# EAGLE design perfboard-tvbgone (EAGLE 5.06)
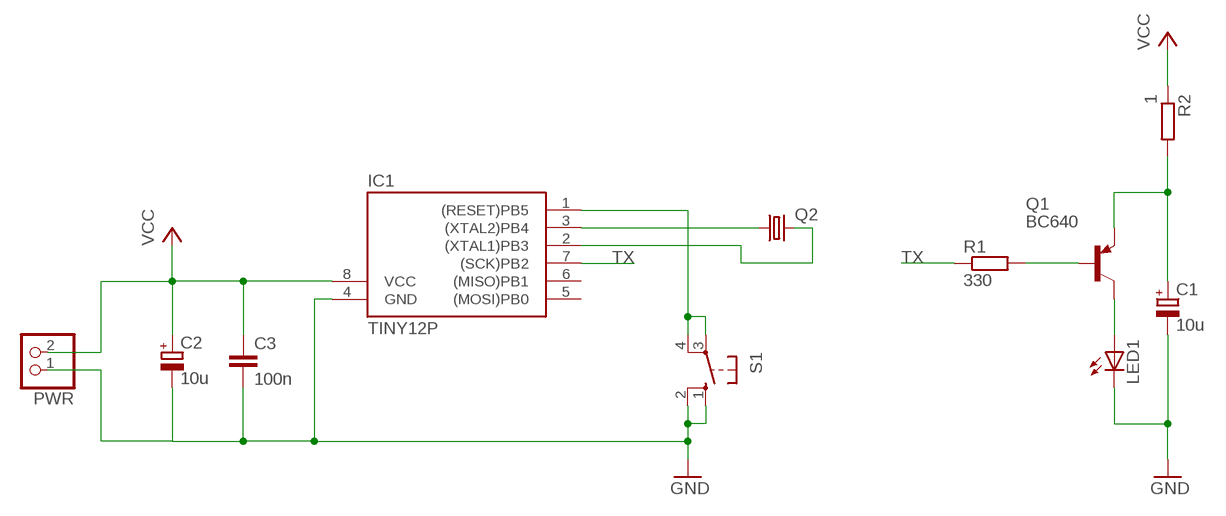
[diagram p0: schematic, sheet 1]

## Parts
C1  10u  CPOL-EUE2-4  [E2-4]
C2  10u  CPOL-EUE2-4  [E2-4]
C3  100n  C-EU050-025X075  [C050-025X075]
IC1  TINY12P  [DIL08]
LED1  LED5MM  [LED5MM]
PWR  PINHD-1X2  [1X02]
Q1  BC640  [TO92-BCE]
Q2  CRYSTALHC49S  [HC49/S]
R1  330  R-EU_0207/7  [0207/7]
R2  1  R-EU_0207/7  [0207/7]
S1  10-XX  [B3F-10XX]

## Nets
GND: C1.- C2.- C3.2 IC1.4(GND) LED1.K(C) PWR.1 S1.1(S) S1.2(S1)
N$7: Q1.B R1.2
N$8: LED1.A Q1.C
N$9: C1.+ Q1.E R2.2
N$10: IC1.3((XTAL2)PB4) Q2.1
N$11: IC1.2((XTAL1)PB3) Q2.2
N$12: IC1.1((RESET)PB5) S1.3(P) S1.4(P1)
TX: IC1.7((SCK)PB2) R1.1
VCC: C2.+ C3.1 IC1.8(VCC) PWR.2 R2.1
Unconnected: IC1.5((MOSI)PB0) IC1.6((MISO)PB1)

## Library data of the parts
C1 C2 = rcl:CPOL-EU: POLARIZED CAPACITOR, European symbol
C3 = rcl:C-EU: CAPACITOR, European symbol
IC1 = atmel:TINY12*: MICROCONTROLLER 1 Kbytes FLASH 64 bytes EEPROM
LED1 = led:LED: LED OSRAM: - CHIPLED LG R971, LG N971, LY N971, LG Q971, LY Q971, LO R971, LY R971 LH N974, LH R974 LS Q976, LO Q976, LY Q976 LO Q996 - Hyper CHIPLED LW Q18S LB Q993, LB Q99A, LB R99A - SideLED LS A670, LO A670, LY A670, LG A670, LP A670 LB A673, LV A673, LT A673, LW A673 LH A674 LY A675 LS A676, LA A676, LO A676, LY A676, LW A676 LS A679, LY A679, LG A679 - Hyper Micro SIDELED® LS Y876, LA Y876, LO Y876, LY Y876 LT Y87S - SmartLED LW L88C, LW L88S LB L89C, LB L89S, LG L890 LS L89K, LO L89K, LY L89K LS L896, LA L896, LO L896, LY L896 - TOPLED LS T670, LO T670, LY T670, LG T670, LP T670 LSG T670, LSP T670, LSY T670, LOP T670, LYG T670 LG T671, LOG T671, LSG T671 LB T673, LV T673, LT T673, LW T673 LH T674 LS T676, LA T676, LO T676, LY T676, LB T676, LH T676, LSB T676, LW T676 LB T67C, LV T67C, LT T67C, LS T67K, LO T67K, LY T67K, LW E67C LS E67B, LA E67B, LO E67B, LY E67B, LB E67C, LV E67C, LT E67C LW T67C LS T679, LY T679, LG T679 LS T770, LO T770, LY T770, LG T770, LP T770 LB T773, LV T773, LT T773, LW T773 LH T774 LS E675, LA E675, LY E675, LS T675 LS T776, LA T776, LO T776, LY T776, LB T776 LHGB T686 LT T68C, LB T68C - Hyper Mini TOPLED® LB M676 - Mini TOPLED Santana® LG M470 LS M47K, LO M47K, LY M47K Source: http://www.osram.convergy.de LUXEON: - LUMILED® LXK2-PW12-R00, LXK2-PW12-S00, LXK2-PW14-U00, LXK2-PW14-V00 LXK2-PM12-R00, LXK2-PM12-S00, LXK2-PM14-U00 LXK2-PE12-Q00, LXK2-PE12-R00, LXK2-PE12-S00, LXK2-PE14-T00, LXK2-PE14-U00 LXK2-PB12-K00, LXK2-PB12-L00, LXK2-PB12-M00, LXK2-PB14-N00, LXK2-PB14-P00, LXK2-PB14-Q00 LXK2-PR12-L00, LXK2-PR12-M00, LXK2-PR14-Q00, LXK2-PR14-R00 LXK2-PD12-Q00, LXK2-PD12-R00, LXK2-PD12-S00 LXK2-PH12-R00, LXK2-PH12-S00 LXK2-PL12-P00, LXK2-PL12-Q00, LXK2-PL12-R00 Source: www.luxeon.com KINGBRIGHT: KA-3528ASYC Source: www.kingbright.com
PWR = pinhead:PINHD-1X2: PIN HEADER
Q1 = transistor-pnp:BC640*: PNP Transistror
Q2 = crystal:CRYSTAL: CRYSTAL
R1 R2 = rcl:R-EU_: RESISTOR, European symbol
S1 = switch-omron:10-XX: OMRON SWITCH

## Board
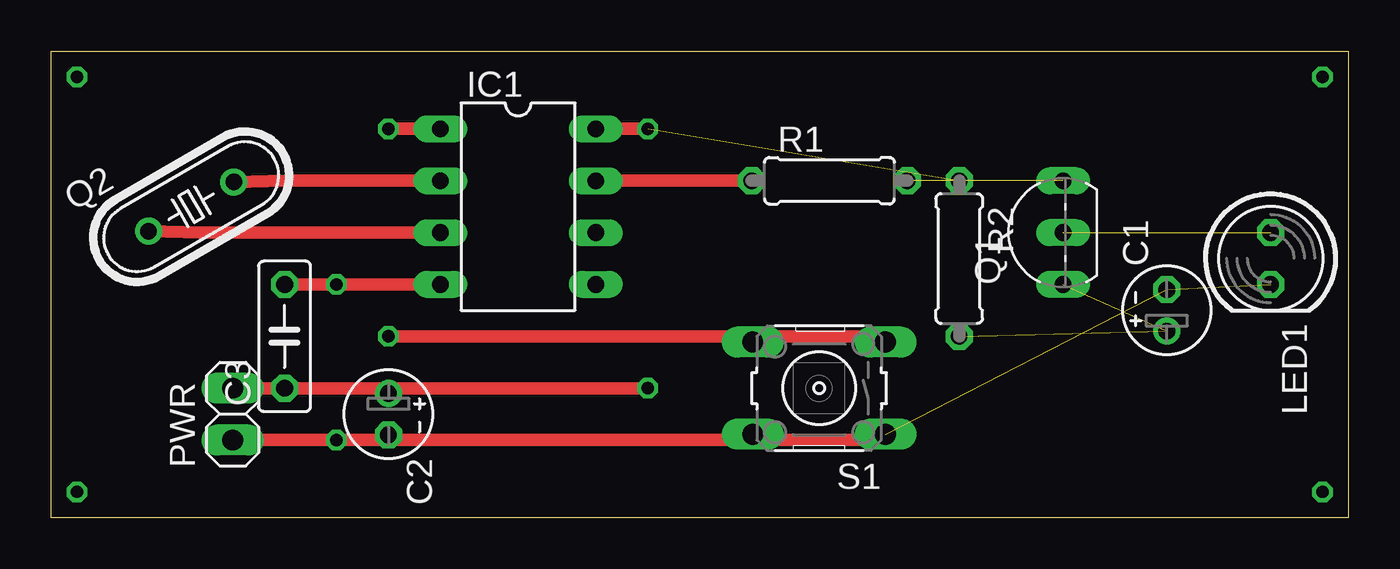
[diagram p1: board, top side]
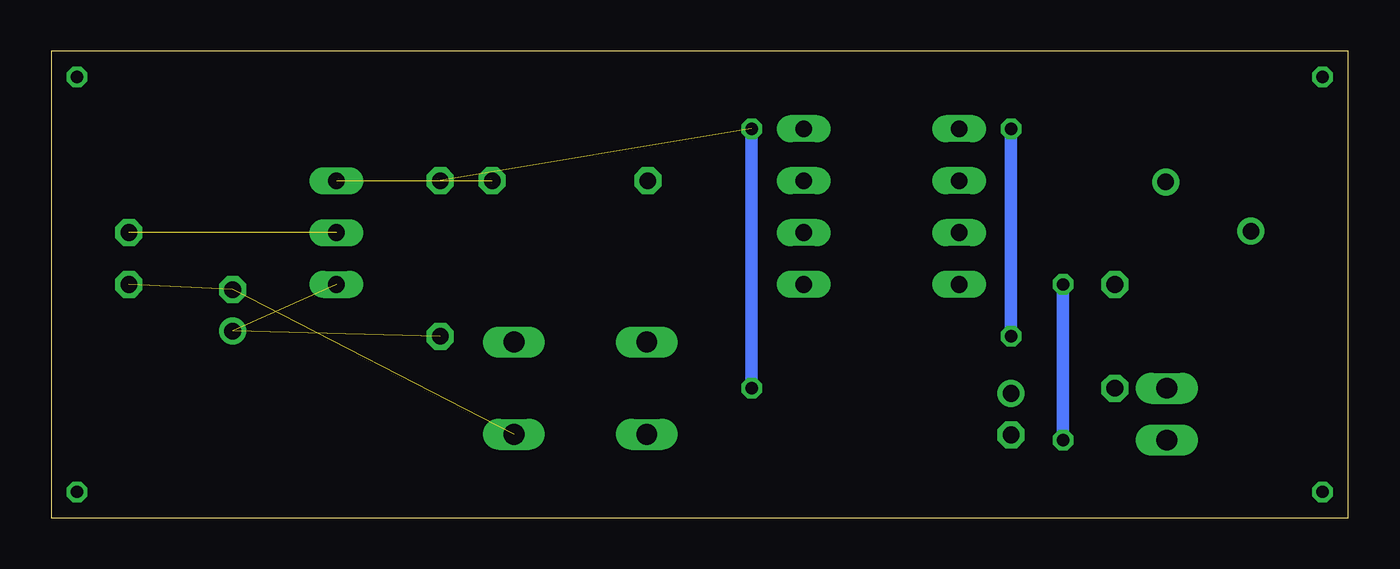
[diagram p2: board, bottom side, seen from below]

Size 63.5 x 22.86 mm. Coordinates in mm from the lower left corner, seen from the top.
Outline: 0,0 0,22.86 63.5,22.86 63.5,0 0,0
Copper layers (1*16): Top 0.035mm / dielectric 1.5mm / Bottom 0.035mm
Design rules "default": minimum track width 10mil, minimum drill 24mil, track to track 8mil, track to pad 8mil, pad to pad 8mil, via to via 8mil, smd to smd 8mil, copper to edge 40mil, drill to drill 8mil, minimum pad ring 10mil, minimum via ring 8mil, stop-mask expansion 4mil, vias tented up to drill 0mil, thermal gap 10mil

### Footprints (pad centres in the part's own frame; a part is rotated, then mirrored left to right if it is on the bottom)
E2-4 = drill 0.813 pad 1.27 round: + -1.016,0 | drill 0.813 pad 1.27 octagon: - 1.016,0
C050-025X075 = drill 0.813 octagon: 1 -2.54,0; 2 2.54,0
DIL08 = drill 0.813 long: 1 -3.81,-3.81; 2 -1.27,-3.81; 3 1.27,-3.81; 4 3.81,-3.81; 5 3.81,3.81; 6 1.27,3.81; 7 -1.27,3.81; 8 -3.81,3.81
LED5MM = drill 0.813 octagon: A -1.27,0; K 1.27,0
1X02 = drill 1.016 long: 1 -1.27,0; 2 1.27,0
TO92-BCE = drill 0.813 long: B 2.54,0; C 0,0; E -2.54,0
HC49/S = drill 0.813 round: 1 -2.413,0; 2 2.413,0
0207/7 = drill 0.813 octagon: 1 -3.81,0; 2 3.81,0
B3F-10XX = drill 1.016 long: 1 -3.251,2.261; 2 3.251,2.261; 3 -3.251,-2.261; 4 3.251,-2.261

### Placement (x,y rotation side)
C1  54.61,10.16 90 top
C2  16.51,5.08 270 top
C3  11.43,8.89 90 top
IC1  22.86,15.24 270 top
LED1  59.69,12.7 270 top
PWR  8.89,5.08 90 top
Q1  49.53,13.97 90 top
Q2  6.86,15.24 30 top
R1  38.1,16.51 0 top
R2  44.45,12.7 270 top
S1  37.59,6.35 180 top

### Tracks (layer width: path | path; a pad name or v marks a point on that pad's centre or on a via)
GND  (via drill 0.6)  (2 unrouted)
  Top 0.61: IC1.4 v13.97,11.43 C3.2 | PWR.1 v13.97,3.81 16.51,3.81 | 16.51,3.81 34.34,3.81 | 16.51,3.81 C2.- | S1.2 34.34,3.81 | 34.34,3.81 40.84,3.81 S1.1
  Bottom 0.61: v13.97,3.81 v13.97,11.43
N$1  (via drill 0.6 pad 0.81)
  other vias: 1.27,1.27
N$2  (via drill 0.6 pad 0.81)
  other vias: 1.27,21.59
N$3  (via drill 0.6 pad 0.81)
  other vias: 62.23,21.59
N$4  (via drill 0.6 pad 0.81)
  other vias: 62.23,1.27
N$7  (1 unrouted)
N$8  (1 unrouted)
N$9  (2 unrouted)
N$10
  Top 0.61: IC1.3 7.31,13.97 Q2.1
N$11
  Top 0.61: IC1.2 11.49,16.51 Q2.2
N$12  (via drill 0.6)
  Top 0.61: v16.51,19.05 IC1.1 | v16.51,8.89 34.34,8.89 S1.4 34.62,8.89 40.84,8.89 S1.3
  Bottom 0.61: v16.51,8.89 v16.51,19.05
TX
  Top 0.61: R1.1 IC1.7
VCC  (via drill 0.6)  (1 unrouted)
  Top 0.61: PWR.2 C3.1 16.51,6.35 | 16.51,6.35 C2.+ | 16.51,6.35 v29.21,6.35 | v29.21,19.05 IC1.8
  Bottom 0.61: v29.21,6.35 v29.21,19.05